# Altium schematic sheet RF SW.SchDoc
size A4; SheetNumber: 3; SheetTotal: 6
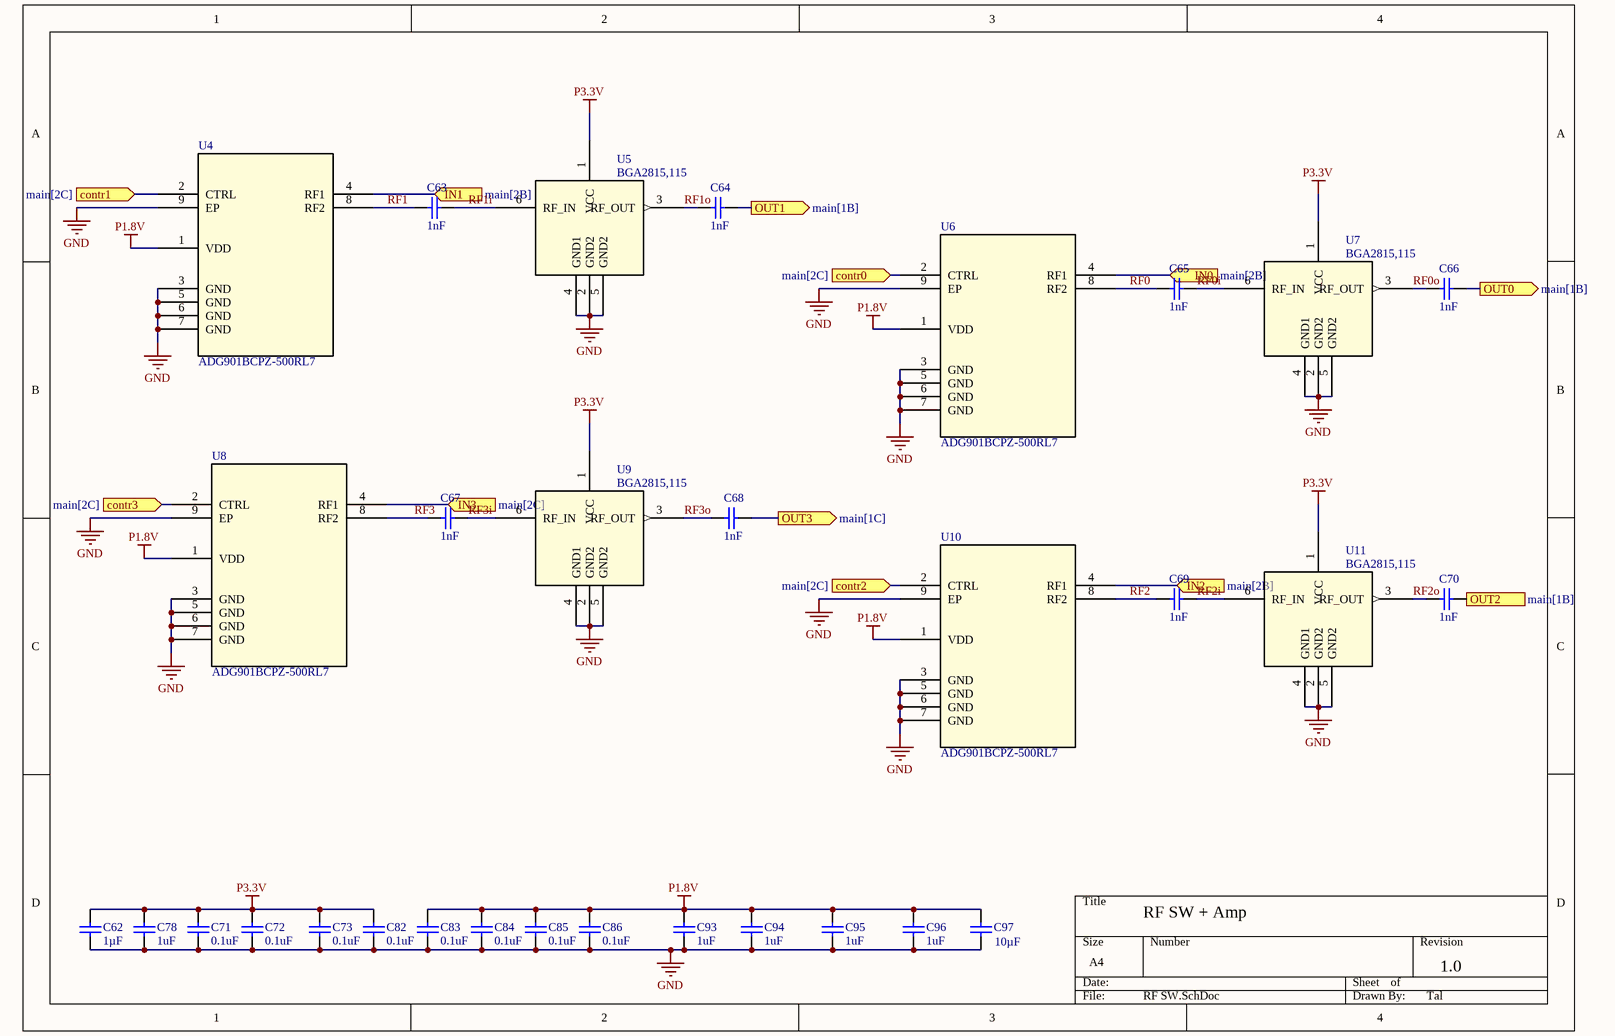
[diagram p0: RF SW.SchDoc]

## Parts
C62  Capacitance: 1µF  [C0603]  (hidden comment: 1uF 16V)
C63  Capacitance: 1nF  [C0402]  (hidden comment: 1nF 25V)
C64  Capacitance: 1nF  [C0402]  (hidden comment: 1nF 25V)
C65  Capacitance: 1nF  [C0402]  (hidden comment: 1nF 25V)
C66  Capacitance: 1nF  [C0402]  (hidden comment: 1nF 25V)
C67  Capacitance: 1nF  [C0402]  (hidden comment: 1nF 25V)
C68  Capacitance: 1nF  [C0402]  (hidden comment: 1nF 25V)
C69  Capacitance: 1nF  [C0402]  (hidden comment: 1nF 25V)
C70  Capacitance: 1nF  [C0402]  (hidden comment: 1nF 25V)
C71  Capacitance: 0.1uF  [C0402]  (hidden comment: 0.1uF 50V)
C72  Capacitance: 0.1uF  [C0402]  (hidden comment: 0.1uF 50V)
C73  Capacitance: 0.1uF  [C0402]  (hidden comment: 0.1uF 50V)
C78  Capacitance: 1uF  [C0402]  (hidden comment: 1uF 25V)
C82  Capacitance: 0.1uF  [C0402]  (hidden comment: 0.1uF 50V)
C83  Capacitance: 0.1uF  [C0402]  (hidden comment: 0.1uF 50V)
C84  Capacitance: 0.1uF  [C0402]  (hidden comment: 0.1uF 50V)
C85  Capacitance: 0.1uF  [C0402]  (hidden comment: 0.1uF 50V)
C86  Capacitance: 0.1uF  [C0402]  (hidden comment: 0.1uF 50V)
C93  Capacitance: 1uF  [C0402]  (hidden comment: 1uF 25V)
C94  Capacitance: 1uF  [C0402]  (hidden comment: 1uF 25V)
C95  Capacitance: 1uF  [C0402]  (hidden comment: 1uF 25V)
C96  Capacitance: 1uF  [C0402]  (hidden comment: 1uF 25V)
C97  Capacitance: 10µF  [C0603]  (hidden comment: 10uF 25V)
U4  ADG901BCPZ-500RL7  [CP_8_2_ADI]
U5  BGA2815,115  [SOT_2815,115_NXP]
U6  ADG901BCPZ-500RL7  [CP_8_2_ADI]
U7  BGA2815,115  [SOT_2815,115_NXP]
U8  ADG901BCPZ-500RL7  [CP_8_2_ADI]
U9  BGA2815,115  [SOT_2815,115_NXP]
U10  ADG901BCPZ-500RL7  [CP_8_2_ADI]
U11  BGA2815,115  [SOT_2815,115_NXP]

## Ports
contr0 (in, see main[2C]), contr1 (in, see main[2C]), contr2 (in, see main[2C]), contr3 (in, see main[2C]), IN0 (in, see main[2B]), IN1 (in, see main[2B]), IN2 (in, see main[2B]), IN3 (in, see main[2C]), OUT0 (out, see main[1B]), OUT1 (out, see main[1B]), OUT2 (out, see main[1B]), OUT3 (out, see main[1C])

## Nets
GND: C62.1 C71.1 C72.1 C73.1 C78.1 C82.1 C83.1 C84.1 C85.1 C86.1 C93.1 C94.1 C95.1 C96.1 C97.1 U4.3(GND) U4.5(GND) U4.6(GND) U4.7(GND) U4.9(EP) U5.2(GND2) U5.4(GND1) U5.5(GND2) U6.3(GND) U6.5(GND) U6.6(GND) U6.7(GND) U6.9(EP) U7.2(GND2) U7.4(GND1) U7.5(GND2) U8.3(GND) U8.5(GND) U8.6(GND) U8.7(GND) U8.9(EP) U9.2(GND2) U9.4(GND1) U9.5(GND2) U10.3(GND) U10.5(GND) U10.6(GND) U10.7(GND) U10.9(EP) U11.2(GND2) U11.4(GND1) U11.5(GND2)
P1.8V: C83.2 C84.2 C85.2 C86.2 C93.2 C94.2 C95.2 C96.2 C97.2 U4.1(VDD) U6.1(VDD) U8.1(VDD) U10.1(VDD)
P3.3V: C62.2 C71.2 C72.2 C73.2 C78.2 C82.2 U5.1(VCC) U7.1(VCC) U9.1(VCC) U11.1(VCC)
contr0: U6.2(CTRL) ; port contr0
contr1: U4.2(CTRL) ; port contr1
contr2: U10.2(CTRL) ; port contr2
contr3: U8.2(CTRL) ; port contr3
IN0: U6.4(RF1) ; port IN0
IN1: U4.4(RF1) ; port IN1
IN2: U10.4(RF1) ; port IN2
IN3: U8.4(RF1) ; port IN3
OUT0: C66.2 ; port OUT0
OUT1: C64.2 ; port OUT1
OUT2: C70.2 ; port OUT2
OUT3: C68.2 ; port OUT3
RF0: C65.1 U6.8(RF2)
RF0i: C65.2 U7.6(RF_IN)
RF0o: C66.1 U7.3(RF_OUT)
RF1: C63.1 U4.8(RF2)
RF1i: C63.2 U5.6(RF_IN)
RF1o: C64.1 U5.3(RF_OUT)
RF2: C69.1 U10.8(RF2)
RF2i: C69.2 U11.6(RF_IN)
RF2o: C70.1 U11.3(RF_OUT)
RF3: C67.1 U8.8(RF2)
RF3i: C67.2 U9.6(RF_IN)
RF3o: C68.1 U9.3(RF_OUT)

## Notes on the sheet
- RF SW + Amp
- 1.0
- Tal

## Library data of the parts
C62 = CAP CER 1uF 16V 10% X7R 0603: Manufacturer: TDK Corporation; Manufacturer Part Number: C1608X7R1C105K; LANDA P/N: ECP-000011; RoHS: RoHS Compliant; ComponentLink1URL: http://www.tdk.com/pdf/general_B11.pdf; ComponentLink1Description: http://www.tdk.com/pdf/general_B11.pdf; Package / Case: 0603 (1608 Metric); Voltage - Rated: 16V
C63-C70 = CAP CER 33nF 25V 10% X7R 0402: CAP CER 1nF 25V 10% X7R 0402; Manufacturer Part Number: C1005X7R1E333K; Manufacturer: TDK Corporation; LANDA P/N: ECP-000045; RoHS: RoHS Compliant; Package / Case: 0402 (1005 Metric); ComponentLink1URL: http://www.tdk.com/pdf/general_B11.pdf; ComponentLink1Description: http://www.tdk.com/pdf/general_B11.pdf; Voltage - Rated: 25V
C71-C73 C82-C86 = CAP CER 6.8pF 50V NP0 0402: CAP CER 0.1uF 50V NP0 0402; Manufacturer Part Number: C1005C0G1H6R8D; Manufacturer: TDK Corporation; LANDA P/N: ECP-000033; RoHS: RoHS Compliant; Package / Case: 0402 (1005 Metric); ComponentLink1URL: http://www.tdk.com/pdf/general_B11.pdf; ComponentLink1Description: http://www.tdk.com/pdf/general_B11.pdf; Voltage - Rated: 50V
C78 C93-C96 = CAP CER 6.8pF 50V NP0 0402: CAP CER 1uF 25V X5R 0402; Manufacturer Part Number: C1005C0G1H6R8D; Manufacturer: TDK Corporation; LANDA P/N: ECP-000033; Voltage - Rated: 50V; RoHS: RoHS Compliant; Package / Case: 0402 (1005 Metric); ComponentLink1URL: http://www.tdk.com/pdf/general_B11.pdf; ComponentLink1Description: http://www.tdk.com/pdf/general_B11.pdf
C97 = CAP CER 10uF 10V 10% X5R 0603: CAP CER 10UF 25V 10% X5R 0603; Manufacturer Part Number: C1608X5R1A106K; Manufacturer: TDK Corporation; LANDA P/N: ECP-000008; Voltage - Rated: 10V; RoHS: RoHS Compliant; ComponentLink1URL: http://www.tdk.com/pdf/general_B11.pdf; ComponentLink1Description: http://www.tdk.com/pdf/general_B11.pdf; Package / Case: 0603 (1608 Metric)
U4 U6 U8 U10 = ADG901BCPZ-500RL7: No Description Available; Mfr_Name: Analog Devices Inc; Copyright: Copyright (C) 2023 Ultra Librarian. All rights reserved.; Manufacturer_Part_Number: ADG901BCPZ-500RL7; RefDes: RefDes; Type: DEV
U5 U7 U9 U11 = BGA2815,115: No Description Available; Mfr_Name: NXP; Copyright: Copyright (C) 2023 Ultra Librarian. All rights reserved.; Manufacturer_Part_Number: BGA2815,115; RefDes: RefDes; Type: DEV